# Altium schematic sheet Sheet1.SchDoc
size A4
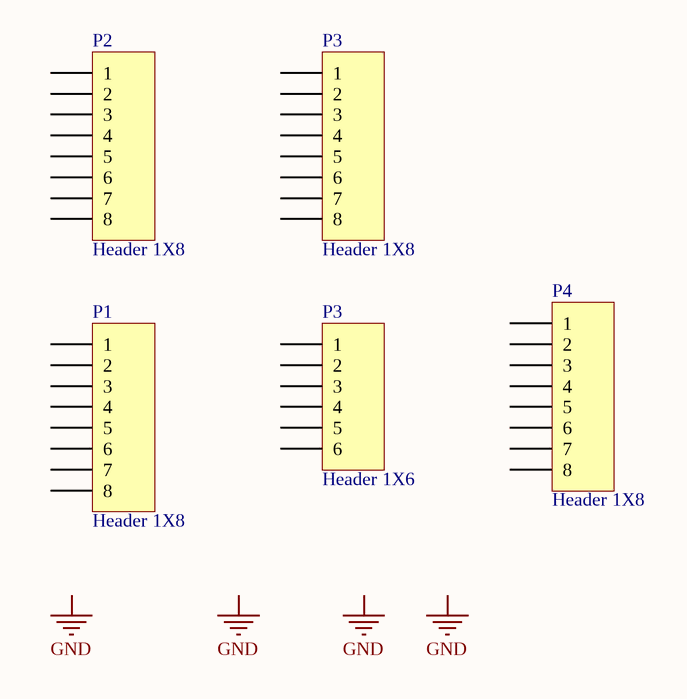
[diagram p0: Sheet1.SchDoc]

## Parts
(Parts that share a designator on the sheet are numbered #1, #2 ... from top to bottom, then left to right.)
P1  Header 1X8  [Header 1X8]
P2  Header 1X8  [Header 1X8]
P3#1  Header 1X8  [Header 1X8]
P3#2  Header 1X6  [Header 1X6]
P4  Header 1X8  [Header 1X8]

## Nets

Not connected (* = marked no-connect by the designer): P1 1 2 3 4 5 6 7 8; P2 1 2 3 4 5 6 7 8; P3#1 1 2 3 4 5 6 7 8; P3#2 1 2 3 4 5 6; P4 1 2 3 4 5 6 7 8

## Notes on the sheet
- Labels drawn without touching a wire or pin: GND

## Library data of the parts
P1 P2 P3#1 P4 = Header 1X8: Header, 8-Pin
P3#2 = Header 1X6: Header, 6-Pin